# EAGLE design panel (EAGLE 8.3.1)
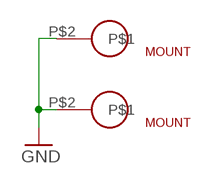
[diagram p0: schematic, sheet 1]

## Parts
U$1  MOUNTPLATED  [MOUNTING-FIRST-PLATED]
U$2  MOUNTPLATED  [MOUNTING-FIRST-PLATED]

## Nets
GND: U$1.P$2 U$2.P$2

## Library data of the parts
U$1 U$2 = barsstronics-mounting:MOUNT

## Board
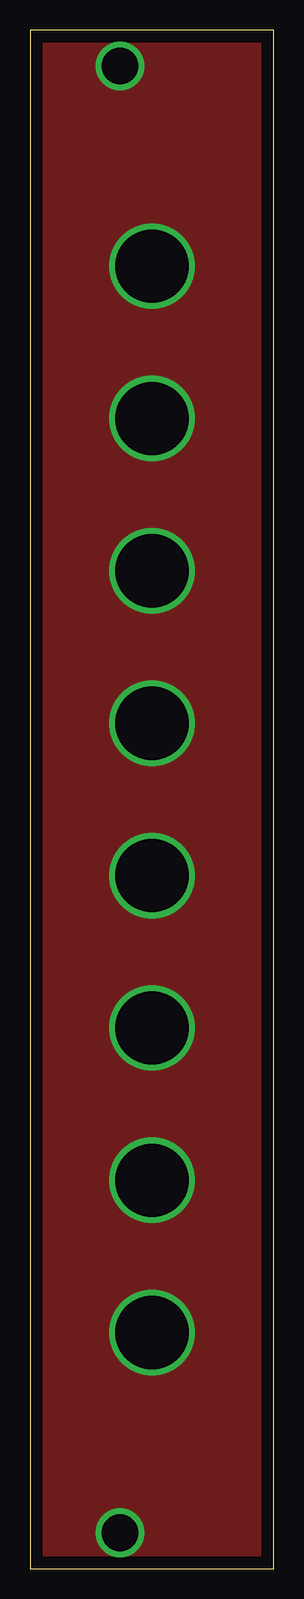
[diagram p1: board, top side]
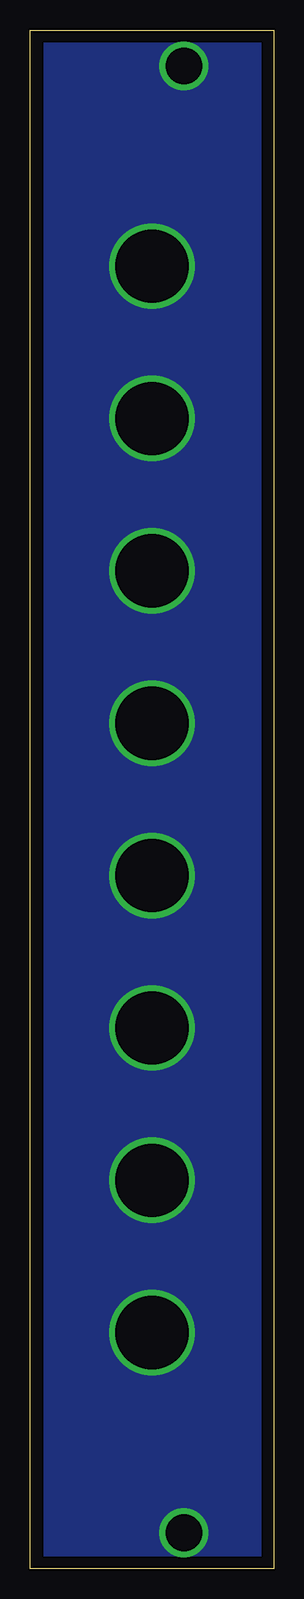
[diagram p2: board, bottom side, seen from below]

Size 20.32 x 128.27 mm. Coordinates in mm from the lower left corner, seen from the top.
Outline: 0,0 20.32,0 20.32,128.27 0,128.27 0,0
Copper layers (1*16): Top 0.035mm / dielectric 1.5mm / Bottom 0.035mm
Design rules "default": minimum track width 10mil, minimum drill 24mil, track to track 8mil, track to pad 8mil, pad to pad 8mil, via to via 8mil, smd to smd 8mil, copper to edge 40mil, drill to drill 8mil, minimum pad ring 10mil, minimum via ring 8mil, stop-mask expansion 4mil, vias tented up to drill 0mil, thermal gap 10mil

### Footprints (pad centres in the part's own frame; a part is rotated, then mirrored left to right if it is on the bottom)
MOUNTING-FIRST-PLATED = drill 3.048: P$2 3,7.5

### Placement (x,y rotation side)
U$1  0,0 90 bottom
U$2  0,128.27 270 top

### Tracks (layer width: path | path; a pad name or v marks a point on that pad's centre or on a via)
GND  (via drill 6.1)
  other vias: 10.16,19.68 10.16,32.39 10.16,45.09 10.16,57.79 10.16,70.48 10.16,83.18 10.16,95.88 10.16,108.58
  pour Top (no thermals): 0,128.91 20.32,128.91 20.32,-0.64 0,-0.64
  pour Bottom (no thermals): 0,128.91 19.05,128.91 19.05,-0.64 0,-0.64